# EAGLE design _InverterSmd (EAGLE 7.3.0)

## Sheet 1 of 2
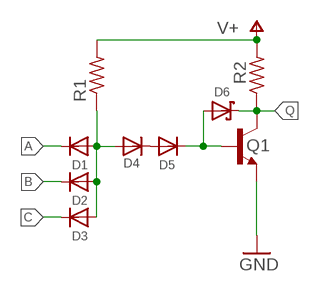
[diagram p0: schematic, sheet 1]

### Parts
D1  DIODE-SOD323  [SOD323F]
D2  DIODE-SOD323  [SOD323F]
D3  DIODE-SOD323  [SOD323F]
D4  DIODE-SOD323  [SOD323F]
D5  DIODE-SOD323  [SOD323F]
D6  SCHOTTKYSOT323  [SOT23]
Q1  BC547-SOT23  [SOT23]
R1  470  R-0805  [R0805]
R2  150  R-0805  [R0805]

### Nets
A: D1.C
B: D2.C
C: D3.C
GND: Q1.2(E)
N$1: D1.A D2.A D3.A D4.A R1.1
N$2: D5.C D6.1(A) Q1.1(B)
N$3: D4.C D5.A
Q: D6.3(C) Q1.3(C) R2.1
V+: R1.2 R2.2

## Sheet 2 of 2

## Library data of the parts
D1-D5 = SmallRoomLabs_Semiconductor:DIODE
D6 = SmallRoomLabs_Semiconductor:SCHOTTKY
Q1 = SmallRoomLabs_Semiconductor:BC547
R1 R2 = SmallRoomLabs_Discrete:R

## Board
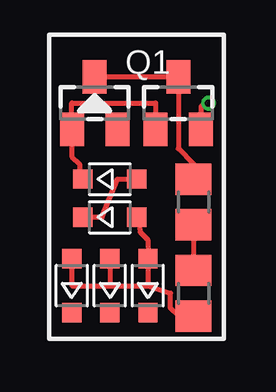
[diagram p1: board, top side]

No outline drawn. Coordinates in mm, seen from the top.
Copper layers (1*16): Top 0.035mm / dielectric 1.5mm / Bottom 0.035mm
Design rules "dirt_cheap_dirty_boards.v1": minimum track width 5mil, minimum drill 12mil, track to track 5mil, track to pad 5mil, pad to pad 5mil, via to via 5mil, smd to smd 0mil, copper to edge 10mil, drill to drill 10mil, minimum pad ring 10mil, minimum via ring 6mil, stop-mask expansion 2mil, vias tented up to drill 25mil, thermal gap 10mil

### Footprints (pad centres in the part's own frame; a part is rotated, then mirrored left to right if it is on the bottom)
SOD323F = smd 0.8 x 0.8: A 1.125,0; C -1.125,0
SOT23 = smd 1 x 1.4: 1 -0.95,-1.1; 2 0.95,-1.1; 3 0,1.1
R0805 = smd 1.3 x 1.5: 1 -0.95,0; 2 0.95,0

### Placement (x,y rotation side)
D1  11.75,28.26 90 top
D2  10.16,28.26 90 top
D3  8.57,28.26 90 top
D4  10.16,31.11 0 top
D5  10.16,32.7 0 top
D6  9.53,35.88 0 top
Q1  13.02,35.88 0 top
R1  13.65,27.94 90 top
R2  13.65,31.75 270 top

### Tracks (layer width: path | path; a pad name or v marks a point on that pad's centre or on a via)
GND  (via drill 0.3)
  Top 0.203: v14.29,35.88 13.97,35.73 Q1.2
N$1
  Top 0.203: R1.1 13.02,26.99 12.7,27.3 12.7,27.94 11.75,28.26 | D2.A 10.16,28.26 | 10.16,28.26 11.75,28.26 | D3.A 8.57,28.26 10.16,28.26 | 11.75,28.26 D1.A 11.75,30.16 11.43,30.48 D4.A
N$2
  Top 0.203: 11.92,34.78 Q1.1 12.07,35.88 8.57,35.88 D6.1 8.57,33.66 8.89,33.34 8.89,32.85 arc90 D5.C
N$3
  Top 0.203: D4.C 9.84,31.11 10.48,32.7 D5.A
Q
  Top 0.203: D6.3 Q1.3 13.02,33.97 13.65,33.34 R2.1
V+
  Top 0.203: R2.2 R1.2